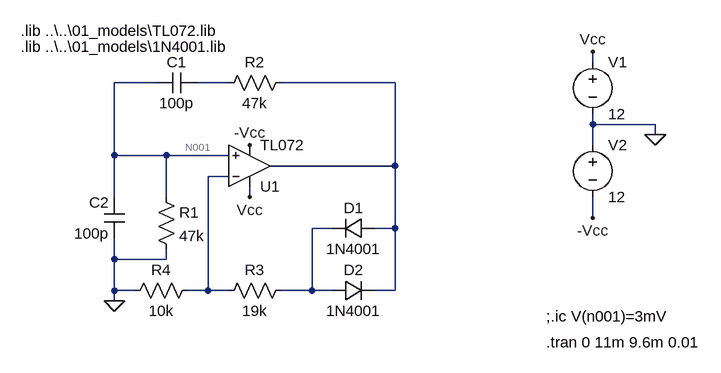
[diagram p0: schematic wien_bridge.asc]
wien_bridge.asc, the LTspice schematic file:
Version 4
SHEET 1 936 680
WIRE 704 -16 704 -32
WIRE 32 16 -32 16
WIRE 144 16 96 16
WIRE 400 16 224 16
WIRE 704 80 704 64
WIRE 800 80 704 80
WIRE 800 96 800 80
WIRE 704 112 704 80
WIRE -32 128 -32 16
WIRE 48 128 -32 128
WIRE 144 128 48 128
WIRE 400 144 400 16
WIRE 400 144 208 144
WIRE 144 160 112 160
WIRE -32 192 -32 128
WIRE 48 192 48 128
WIRE 176 192 176 176
WIRE 704 224 704 192
WIRE 304 240 272 240
WIRE 400 240 400 144
WIRE 400 240 368 240
WIRE -32 288 -32 256
WIRE 48 288 48 272
WIRE 48 288 -32 288
WIRE -32 336 -32 288
WIRE 0 336 -32 336
WIRE 112 336 112 160
WIRE 112 336 80 336
WIRE 144 336 112 336
WIRE 272 336 272 240
WIRE 272 336 224 336
WIRE 304 336 272 336
WIRE 400 336 400 240
WIRE 400 336 368 336
WIRE -32 352 -32 336
FLAG 800 96 0
FLAG 704 -32 Vcc
FLAG 704 224 -Vcc
FLAG 176 112 -Vcc
FLAG 176 192 Vcc
FLAG -32 352 0
SYMBOL cap 96 0 R90
WINDOW 0 0 32 VBottom 2
WINDOW 3 32 32 VTop 2
SYMATTR InstName C1
SYMATTR Value 100p
SYMBOL cap -16 256 R180
WINDOW 0 24 56 Left 2
WINDOW 3 24 8 Left 2
SYMATTR InstName C2
SYMATTR Value 100p
SYMBOL res 32 176 R0
SYMATTR InstName R1
SYMATTR Value 47k
SYMBOL res 240 0 R90
WINDOW 0 0 56 VBottom 2
WINDOW 3 32 56 VTop 2
SYMATTR InstName R2
SYMATTR Value 47k
SYMBOL res 240 320 R90
WINDOW 0 0 56 VBottom 2
WINDOW 3 32 56 VTop 2
SYMATTR InstName R3
SYMATTR Value 19k
SYMBOL res 96 320 R90
WINDOW 0 0 56 VBottom 2
WINDOW 3 32 56 VTop 2
SYMATTR InstName R4
SYMATTR Value 10k
SYMBOL diode 368 224 R90
WINDOW 0 0 32 VBottom 2
WINDOW 3 32 32 VTop 2
SYMATTR InstName D1
SYMATTR Value 1N4001
SYMBOL diode 304 352 R270
WINDOW 0 32 32 VTop 2
WINDOW 3 0 32 VBottom 2
SYMATTR InstName D2
SYMATTR Value 1N4001
SYMBOL voltage 704 -32 R0
WINDOW 123 0 0 Left 2
WINDOW 39 0 0 Left 2
SYMATTR InstName V1
SYMATTR Value 12
SYMBOL voltage 704 96 R0
WINDOW 123 0 0 Left 2
WINDOW 39 0 0 Left 2
SYMATTR InstName V2
SYMATTR Value 12
SYMBOL Opamps\\opamp2 176 208 M180
SYMATTR InstName U1
SYMATTR Value TL072
TEXT 632 416 Left 2 !.tran 0 11m 9.6m 0.01
TEXT 632 376 Left 2 !;.ic V(n001)=3mV
TEXT -176 -64 Left 2 !.lib ..\\..\\01_models\\TL072.lib
TEXT -176 -40 Left 2 !.lib ..\\..\\01_models\\1N4001.lib

The netlist it stands for:
* wien_bridge.asc
C1 N002 N001 100p
C2 0 N001 100p
R1 N001 0 47k
R2 N003 N002 47k
R3 N005 N004 19k
R4 N004 0 10k
D1 N003 N005 1N4001
D2 N005 N003 1N4001
V1 Vcc 0 12
V2 0 -Vcc 12
XU1 N001 N004 Vcc -Vcc N003 TL072  ; pins In+ In- V+ V- OUT
.model D D
.lib standard.dio
.tran 0 11m 9.6m 0.01
;.ic V(n001)=3mV
.lib ..\..\01_models\TL072.lib
.lib ..\..\01_models\1N4001.lib
.backanno
.end